# Altium schematic sheet levelshift12_5.SchDoc
size A; Organization: Cal Poly Racing; engineer1: who?
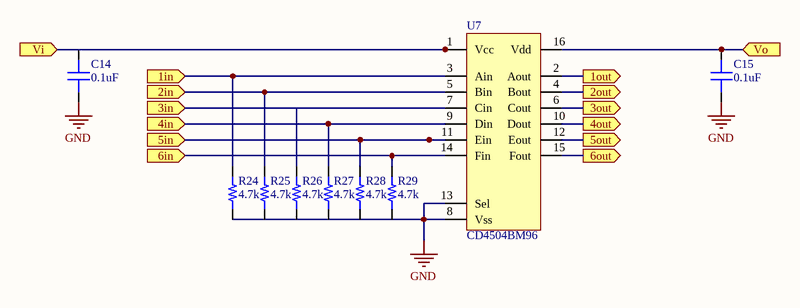
[diagram p0: levelshift12_5.SchDoc]

## Parts
C14  capacitance: 0.1uF  [0603]  (hidden comment: capacitor)
C15  capacitance: 0.1uF  [0603]  (hidden comment: capacitor)
R24  4.7k  [RES 0603/1608]
R25  4.7k  [RES 0603/1608]
R26  4.7k  [RES 0603/1608]
R27  4.7k  [RES 0603/1608]
R28  4.7k  [RES 0603/1608]
R29  4.7k  [RES 0603/1608]
U7  CD4504BM96  [SOIC-16]

## Ports
1in (in), 1out (out), 2in (in), 2out (out), 3in (in), 3out (out), 4in (in), 4out (out), 5in (in), 5out (out), 6in (in), 6out (out), Vi (in), Vo (in)

## Nets
GND: C14.1 C15.1 R24.1 R25.1 R26.1 R27.1 R28.1 R29.1 U7.8(Vss) U7.13(Sel)
1in: R24.2 U7.3(Ain) ; port 1in
1out: U7.2(Aout) ; port 1out
2in: R25.2 U7.5(Bin) ; port 2in
2out: U7.4(Bout) ; port 2out
3in: R26.2 U7.7(Cin) ; port 3in
3out: U7.6(Cout) ; port 3out
4in: R27.2 U7.9(Din) ; port 4in
4out: U7.10(Dout) ; port 4out
5in: R28.2 U7.11(Ein) ; port 5in
5out: U7.12(Eout) ; port 5out
6in: R29.2 U7.14(Fin) ; port 6in
6out: U7.15(Fout) ; port 6out
Vi: C14.2 U7.1(Vcc) ; port Vi
Vo: C15.2 U7.16(Vdd) ; port Vo

## Notes on the sheet
- Date:
- Time:
- File:

## Library data of the parts
C14 C15 = 1: Generic 0603 capacitor; id: 1
R24-R29 = 1: id: 1; name: 0603 Resistor; percent tolerance: 5; resistance: 4.7k; package: 0603; quantity: 0
U7 = 1: Voltage Level Translator Unidirectional 1 Cir; id: 1; Vcc: 20; Name: CD4504BM96; type: Level shifter CMOS-CMOS; package: SOIC-16; quantity: 0; link: https://www.digikey.com/product-detail/en/texas-instruments/CD4504BM96/296-14150-2-ND/525968